# Altium schematic sheet jtag-switch.SchDoc: Copper Suicide - JTAG Switch
size Letter; CheckedBy: J. Brinton; CompanyName: Signal Laboratories, Inc.; DrawnBy: J. Brinton; Engineer: J. Brinton; Address1: 3479 Edison Way; Address2: Menlo Park CA 94025; Address3: +1 (877) 778-8435; Address4: siglabs.com; Revision: 3; SheetNumber: 39; SheetTotal: 47
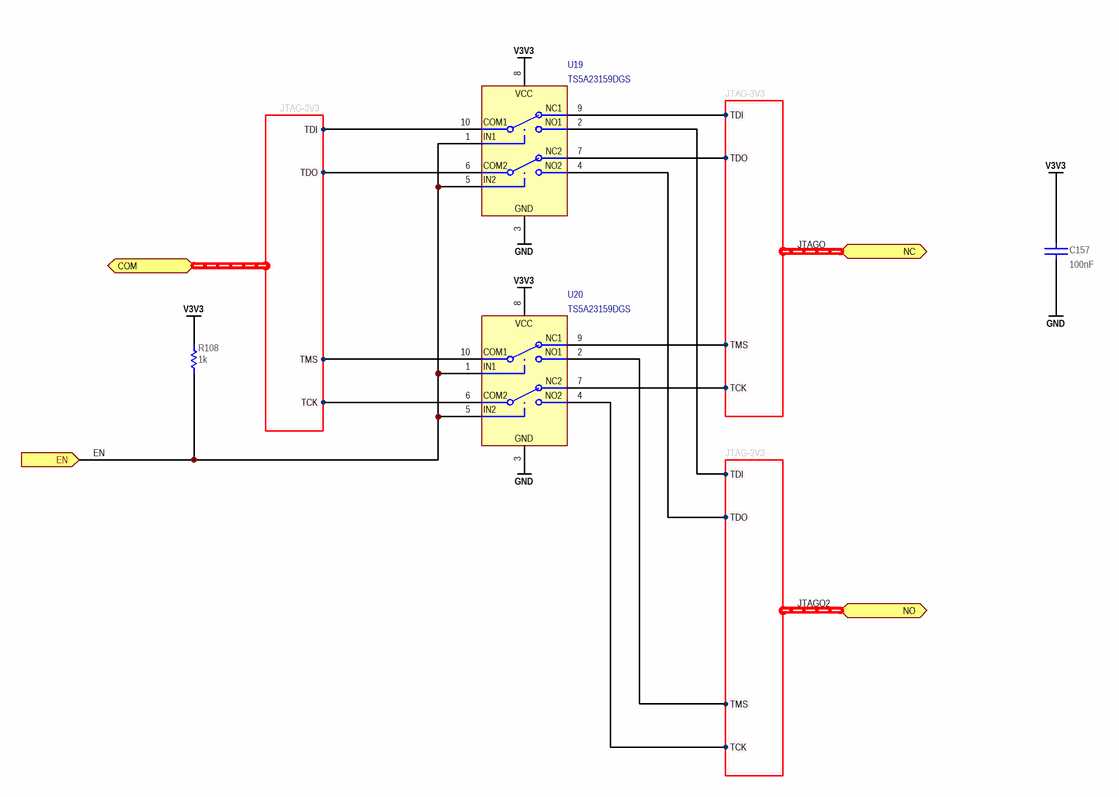
[diagram p0: jtag-switch.SchDoc]

## Parts
C157  value 100nF  [CAPC100X50X55L25N]  (hidden comment: GCM155R71H104KE02)
R108  value 1k  [RESC1005X40N]  (hidden comment: ERJ-2RKF1001X)
U19  TS5A23159DGS  [DGS-10]
U20  TS5A23159DGS  [DGS-10]

## Ports
COM (harness JTAG-3V3), EN (in), NC (harness JTAG-3V3), NO (harness JTAG-3V3)

## Harnesses
JTAG-3V3: TMS, TCK, TDI, TDO

## Nets
GND: C157.1 U19.3(GND) U20.3(GND)
V3V3: C157.2 R108.2 U19.8(VCC) U20.8(VCC)
EN: R108.1 U19.1(IN1) U19.5(IN2) U20.1(IN1) U20.5(IN2) ; port EN
JTAGO2.TCK: U20.4(NO2) ; port NO.TCK
JTAGO2.TDI: U19.2(NO1) ; port NO.TDI
JTAGO2.TDO: U19.4(NO2) ; port NO.TDO
JTAGO2.TMS: U20.2(NO1) ; port NO.TMS
JTAGO.TCK: U20.7(NC2) ; port NC.TCK
JTAGO.TDI: U19.9(NC1) ; port NC.TDI
JTAGO.TDO: U19.7(NC2) ; port NC.TDO
JTAGO.TMS: U20.9(NC1) ; port NC.TMS
NetU19_6: U19.6(COM2) ; port COM.TDO
NetU19_10: U19.10(COM1) ; port COM.TDI
NetU20_6: U20.6(COM2) ; port COM.TCK
NetU20_10: U20.10(COM1) ; port COM.TMS

## Buses and harness runs
harness JTAGO2 = port NO
harness JTAGO = port NC

## Notes on the sheet
- Title
- Engineer
- Revision
- Drawn By
- Checked By
- Date
- Sheet
- of

## Library data of the parts
C157 = CAP: Ceramic Capacitor 100nF ±10% 50V X7R 0402; Manufacturer: Murata; Tr: -55:125; Manufacturer P/N: GCM155R71H104KE02; Tolerance: ±10%; Voltage: 50V; Footprint: *; Package: 0402
R108 = RES: Thick Film Resistor 1k ±1% 0.1W 50V 0402; Manufacturer: Panasonic; Tcr: ±100; Tr: -55:155; Voltage: 50; Power: 0.1; Manufacturer P/N: ERJ-2RKF1001X; Tolerance: ±1%; Alternatives: *; Footprint: *; Package: 0402
U19 U20 = TS5A23159DGS: 2-Channel SPDT Analog Switch; Manufacturer: Texas Instruments; Manufacturer P/N: TS5A23159DGS